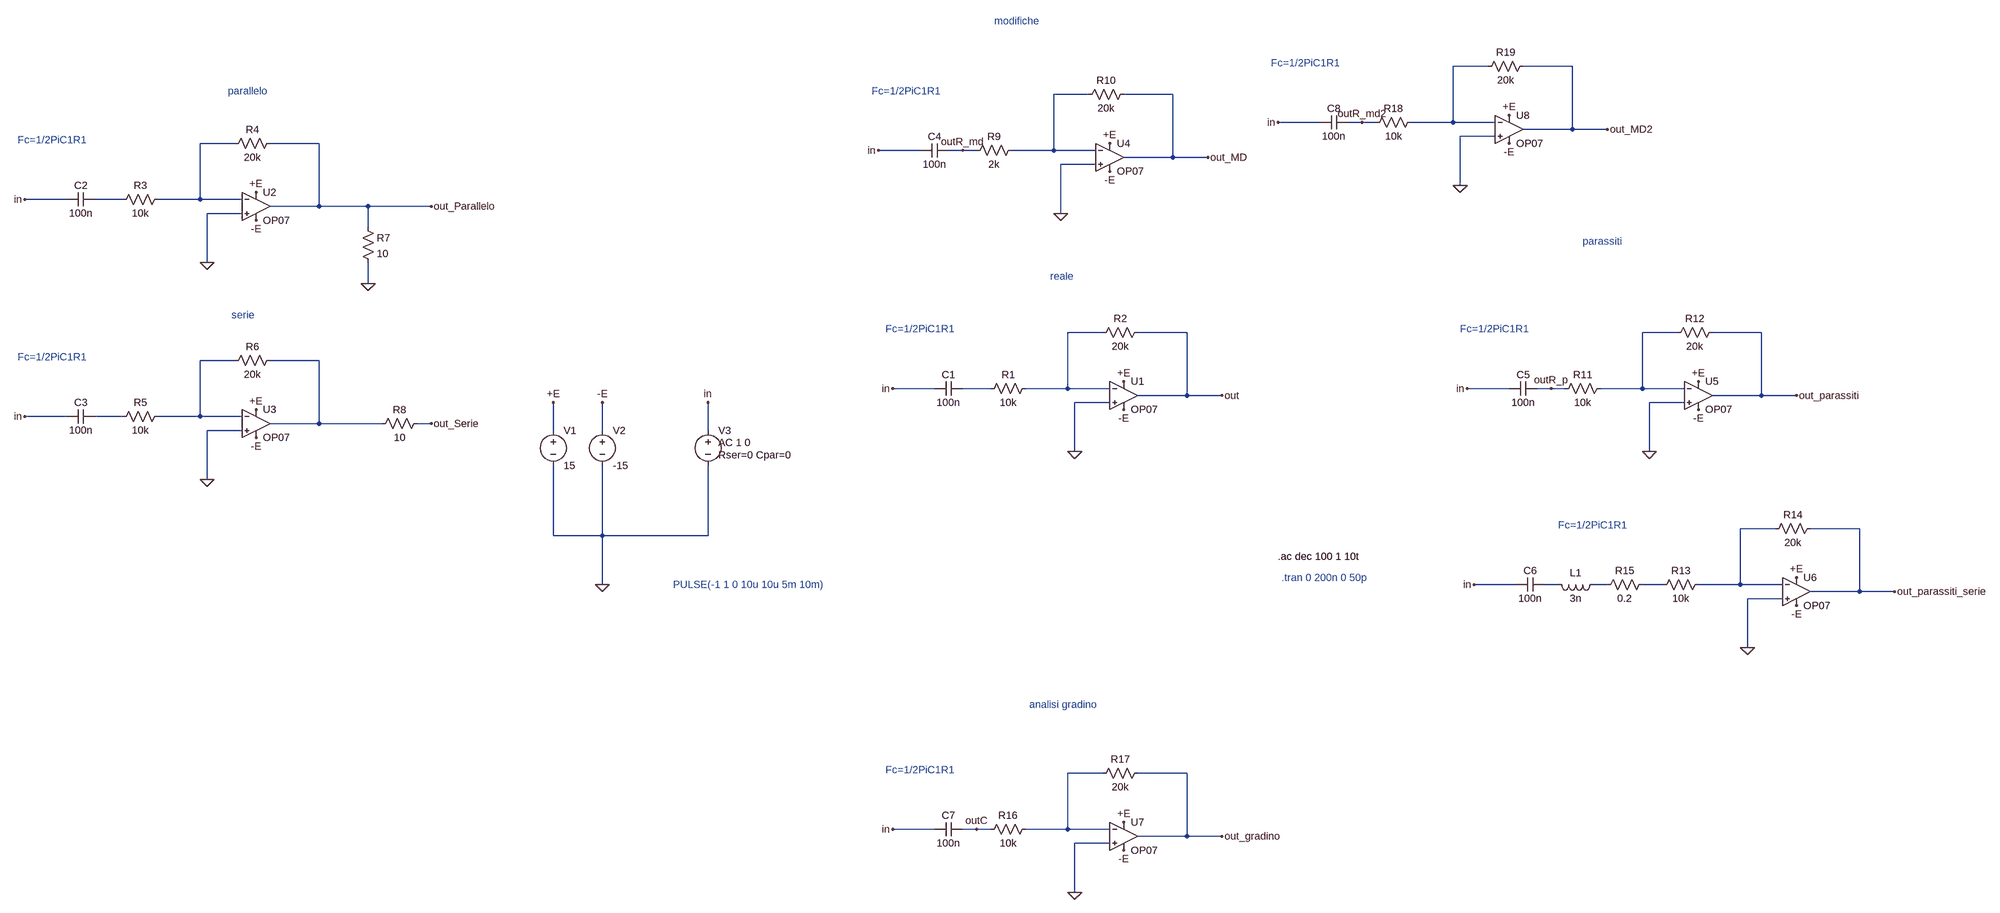
[diagram p0: schematic attivo-reale.asc]
attivo-reale.asc, the LTspice schematic file:
Version 4.1
SHEET 1 2816 916
WIRE 1648 -1056 1568 -1056
WIRE 1840 -1056 1728 -1056
WIRE 736 -992 656 -992
WIRE 928 -992 816 -992
WIRE 1264 -928 1168 -928
WIRE 1360 -928 1328 -928
WIRE 1392 -928 1360 -928
WIRE 1568 -928 1568 -1056
WIRE 1568 -928 1472 -928
WIRE 1664 -928 1568 -928
WIRE 1840 -912 1840 -1056
WIRE 1840 -912 1728 -912
WIRE 1920 -912 1840 -912
WIRE 1664 -896 1584 -896
WIRE -1680 -880 -1760 -880
WIRE -1488 -880 -1600 -880
WIRE 352 -864 256 -864
WIRE 448 -864 416 -864
WIRE 480 -864 448 -864
WIRE 656 -864 656 -992
WIRE 656 -864 560 -864
WIRE 752 -864 656 -864
WIRE 928 -848 928 -992
WIRE 928 -848 816 -848
WIRE 1008 -848 928 -848
WIRE 752 -832 672 -832
WIRE 1584 -784 1584 -896
WIRE -2064 -752 -2160 -752
WIRE -1936 -752 -2000 -752
WIRE -1760 -752 -1760 -880
WIRE -1760 -752 -1856 -752
WIRE -1664 -752 -1760 -752
WIRE -1488 -736 -1488 -880
WIRE -1488 -736 -1600 -736
WIRE -1376 -736 -1488 -736
WIRE -1232 -736 -1376 -736
WIRE -1664 -720 -1744 -720
WIRE 672 -720 672 -832
WIRE -1376 -688 -1376 -736
WIRE -1744 -608 -1744 -720
WIRE -1376 -560 -1376 -608
WIRE 768 -448 688 -448
WIRE 960 -448 848 -448
WIRE 2080 -448 2000 -448
WIRE 2272 -448 2160 -448
WIRE -1680 -384 -1760 -384
WIRE -1488 -384 -1600 -384
WIRE 384 -320 288 -320
WIRE 512 -320 448 -320
WIRE 688 -320 688 -448
WIRE 688 -320 592 -320
WIRE 784 -320 688 -320
WIRE 1696 -320 1600 -320
WIRE 1792 -320 1760 -320
WIRE 1824 -320 1792 -320
WIRE 2000 -320 2000 -448
WIRE 2000 -320 1904 -320
WIRE 2096 -320 2000 -320
WIRE 960 -304 960 -448
WIRE 960 -304 848 -304
WIRE 1040 -304 960 -304
WIRE 2272 -304 2272 -448
WIRE 2272 -304 2160 -304
WIRE 2352 -304 2272 -304
WIRE 784 -288 704 -288
WIRE 2096 -288 2016 -288
WIRE -2064 -256 -2160 -256
WIRE -1936 -256 -2000 -256
WIRE -1760 -256 -1760 -384
WIRE -1760 -256 -1856 -256
WIRE -1664 -256 -1760 -256
WIRE -1488 -240 -1488 -384
WIRE -1488 -240 -1600 -240
WIRE -1344 -240 -1488 -240
WIRE -1232 -240 -1264 -240
WIRE -1664 -224 -1744 -224
WIRE -560 -224 -560 -288
WIRE -448 -224 -448 -288
WIRE -160 -224 -160 -288
WIRE 704 -176 704 -288
WIRE 2016 -176 2016 -288
WIRE -1744 -112 -1744 -224
WIRE 2304 0 2224 0
WIRE 2496 0 2384 0
WIRE -560 16 -560 -144
WIRE -448 16 -448 -144
WIRE -448 16 -560 16
WIRE -160 16 -160 -144
WIRE -160 16 -448 16
WIRE -448 128 -448 16
WIRE 1712 128 1616 128
WIRE 1808 128 1776 128
WIRE 1920 128 1888 128
WIRE 2048 128 2000 128
WIRE 2224 128 2224 0
WIRE 2224 128 2128 128
WIRE 2320 128 2224 128
WIRE 2496 144 2496 0
WIRE 2496 144 2384 144
WIRE 2576 144 2496 144
WIRE 2320 160 2240 160
WIRE 2240 272 2240 160
WIRE 768 624 688 624
WIRE 960 624 848 624
WIRE 384 752 288 752
WIRE 480 752 448 752
WIRE 512 752 480 752
WIRE 688 752 688 624
WIRE 688 752 592 752
WIRE 784 752 688 752
WIRE 960 768 960 624
WIRE 960 768 848 768
WIRE 1040 768 960 768
WIRE 784 784 704 784
WIRE 704 896 704 784
FLAG -560 -288 +E
FLAG -448 -288 -E
FLAG -160 -288 in
FLAG 704 -176 0
FLAG 816 -336 +E
FLAG 816 -272 -E
FLAG 1040 -304 out
FLAG 288 -320 in
FLAG -448 128 0
FLAG -1744 -608 0
FLAG -1632 -768 +E
FLAG -1632 -704 -E
FLAG -2160 -752 in
FLAG -1744 -112 0
FLAG -1632 -272 +E
FLAG -1632 -208 -E
FLAG -2160 -256 in
FLAG -1376 -560 0
FLAG -1232 -736 out_Parallelo
FLAG -1232 -240 out_Serie
FLAG 672 -720 0
FLAG 784 -880 +E
FLAG 784 -816 -E
FLAG 1008 -848 out_MD
FLAG 256 -864 in
FLAG 2016 -176 0
FLAG 2128 -336 +E
FLAG 2128 -272 -E
FLAG 2352 -304 out_parassiti
FLAG 1600 -320 in
FLAG 2240 272 0
FLAG 2352 112 +E
FLAG 2352 176 -E
FLAG 2576 144 out_parassiti_serie
FLAG 1616 128 in
FLAG 704 896 0
FLAG 816 736 +E
FLAG 816 800 -E
FLAG 1040 768 out_gradino
FLAG 288 752 in
FLAG 480 752 outC
FLAG 448 -864 outR_md
FLAG 1584 -784 0
FLAG 1696 -944 +E
FLAG 1696 -880 -E
FLAG 1920 -912 out_MD2
FLAG 1168 -928 in
FLAG 1360 -928 outR_md2
FLAG 1792 -320 outR_p
SYMBOL voltage -560 -240 R0
WINDOW 123 0 0 Left 0
WINDOW 39 0 0 Left 0
SYMATTR InstName V1
SYMATTR Value 15
SYMBOL voltage -448 -240 R0
WINDOW 123 0 0 Left 0
WINDOW 39 0 0 Left 0
SYMATTR InstName V2
SYMATTR Value -15
SYMBOL cap 448 -336 R90
WINDOW 0 0 32 VBottom 2
WINDOW 3 32 32 VTop 2
SYMATTR InstName C1
SYMATTR Value 100n
SYMBOL res 608 -336 R90
WINDOW 0 0 56 VBottom 2
WINDOW 3 32 56 VTop 2
SYMATTR InstName R1
SYMATTR Value 10k
SYMBOL res 864 -464 R90
WINDOW 0 0 56 VBottom 2
WINDOW 3 32 56 VTop 2
SYMATTR InstName R2
SYMATTR Value 20k
SYMBOL cap -2000 -768 R90
WINDOW 0 0 32 VBottom 2
WINDOW 3 32 32 VTop 2
SYMATTR InstName C2
SYMATTR Value 100n
SYMBOL res -1840 -768 R90
WINDOW 0 0 56 VBottom 2
WINDOW 3 32 56 VTop 2
SYMATTR InstName R3
SYMATTR Value 10k
SYMBOL res -1584 -896 R90
WINDOW 0 0 56 VBottom 2
WINDOW 3 32 56 VTop 2
SYMATTR InstName R4
SYMATTR Value 20k
SYMBOL cap -2000 -272 R90
WINDOW 0 0 32 VBottom 2
WINDOW 3 32 32 VTop 2
SYMATTR InstName C3
SYMATTR Value 100n
SYMBOL res -1840 -272 R90
WINDOW 0 0 56 VBottom 2
WINDOW 3 32 56 VTop 2
SYMATTR InstName R5
SYMATTR Value 10k
SYMBOL res -1584 -400 R90
WINDOW 0 0 56 VBottom 2
WINDOW 3 32 56 VTop 2
SYMATTR InstName R6
SYMATTR Value 20k
SYMBOL res -1392 -704 R0
SYMATTR InstName R7
SYMATTR Value 10
SYMBOL res -1248 -256 R90
WINDOW 0 0 56 VBottom 2
WINDOW 3 32 56 VTop 2
SYMATTR InstName R8
SYMATTR Value 10
SYMBOL cap 416 -880 R90
WINDOW 0 0 32 VBottom 2
WINDOW 3 32 32 VTop 2
SYMATTR InstName C4
SYMATTR Value 100n
SYMBOL res 576 -880 R90
WINDOW 0 0 56 VBottom 2
WINDOW 3 32 56 VTop 2
SYMATTR InstName R9
SYMATTR Value 2k
SYMBOL res 832 -1008 R90
WINDOW 0 0 56 VBottom 2
WINDOW 3 32 56 VTop 2
SYMATTR InstName R10
SYMATTR Value 20k
SYMBOL cap 1760 -336 R90
WINDOW 0 0 32 VBottom 2
WINDOW 3 32 32 VTop 2
SYMATTR InstName C5
SYMATTR Value 100n
SYMATTR SpiceLine V=0 Irms=0 Rser=0.2 Lser=3n Rpar=0 Cpar=0
SYMBOL res 1920 -336 R90
WINDOW 0 0 56 VBottom 2
WINDOW 3 32 56 VTop 2
SYMATTR InstName R11
SYMATTR Value 10k
SYMBOL res 2176 -464 R90
WINDOW 0 0 56 VBottom 2
WINDOW 3 32 56 VTop 2
SYMATTR InstName R12
SYMATTR Value 20k
SYMBOL cap 1776 112 R90
WINDOW 0 0 32 VBottom 2
WINDOW 3 32 32 VTop 2
SYMATTR InstName C6
SYMATTR Value 100n
SYMATTR SpiceLine V=0 Irms=0 Rser=0 Lser=0 Rpar=0 Cpar=0
SYMBOL res 2144 112 R90
WINDOW 0 0 56 VBottom 2
WINDOW 3 32 56 VTop 2
SYMATTR InstName R13
SYMATTR Value 10k
SYMBOL res 2400 -16 R90
WINDOW 0 0 56 VBottom 2
WINDOW 3 32 56 VTop 2
SYMATTR InstName R14
SYMATTR Value 20k
SYMBOL ind 1904 112 R90
WINDOW 0 5 56 VBottom 2
WINDOW 3 32 56 VTop 2
SYMATTR InstName L1
SYMATTR Value 3n
SYMATTR SpiceLine Rser=1m
SYMBOL res 2016 112 R90
WINDOW 0 0 56 VBottom 2
WINDOW 3 32 56 VTop 2
SYMATTR InstName R15
SYMATTR Value 0.2
SYMBOL voltage -160 -240 R0
WINDOW 123 24 44 Left 2
WINDOW 39 24 72 Left 2
WINDOW 3 24 100 Left 2
SYMATTR Value2 AC 1 0
SYMATTR SpiceLine Rser=0 Cpar=0
SYMATTR Value ""
SYMATTR InstName V3
SYMBOL cap 448 736 R90
WINDOW 0 0 32 VBottom 2
WINDOW 3 32 32 VTop 2
SYMATTR InstName C7
SYMATTR Value 100n
SYMBOL res 608 736 R90
WINDOW 0 0 56 VBottom 2
WINDOW 3 32 56 VTop 2
SYMATTR InstName R16
SYMATTR Value 10k
SYMBOL res 864 608 R90
WINDOW 0 0 56 VBottom 2
WINDOW 3 32 56 VTop 2
SYMATTR InstName R17
SYMATTR Value 20k
SYMBOL OpAmps\\OP07 816 -368 R0
SYMATTR InstName U1
SYMBOL OpAmps\\OP07 -1632 -800 R0
SYMATTR InstName U2
SYMBOL OpAmps\\OP07 -1632 -304 R0
SYMATTR InstName U3
SYMBOL OpAmps\\OP07 784 -912 R0
SYMATTR InstName U4
SYMBOL OpAmps\\OP07 2128 -368 R0
SYMATTR InstName U5
SYMBOL OpAmps\\OP07 2352 80 R0
SYMATTR InstName U6
SYMBOL OpAmps\\OP07 816 704 R0
SYMATTR InstName U7
SYMBOL cap 1328 -944 R90
WINDOW 0 0 32 VBottom 2
WINDOW 3 32 32 VTop 2
SYMATTR InstName C8
SYMATTR Value 100n
SYMBOL res 1488 -944 R90
WINDOW 0 0 56 VBottom 2
WINDOW 3 32 56 VTop 2
SYMATTR InstName R18
SYMATTR Value 10k
SYMBOL res 1744 -1072 R90
WINDOW 0 0 56 VBottom 2
WINDOW 3 32 56 VTop 2
SYMATTR InstName R19
SYMATTR Value 20k
SYMBOL OpAmps\\OP07 1696 -976 R0
SYMATTR InstName U8
TEXT 272 -456 Left 2 ;Fc=1/2PiC1R1
TEXT 1168 64 Left 2 !.ac dec 100 1 10t
TEXT 1176 112 Left 2 ;.tran 0 200n 0 50p
TEXT -2176 -888 Left 2 ;Fc=1/2PiC1R1
TEXT -2176 -392 Left 2 ;Fc=1/2PiC1R1
TEXT 240 -1000 Left 2 ;Fc=1/2PiC1R1
TEXT -1696 -1000 Left 2 ;parallelo
TEXT -1688 -488 Left 2 ;serie
TEXT 520 -1160 Left 2 ;modifiche
TEXT 1584 -456 Left 2 ;Fc=1/2PiC1R1
TEXT 1864 -656 Left 2 ;parassiti
TEXT 1808 -8 Left 2 ;Fc=1/2PiC1R1
TEXT 648 -576 Left 2 ;reale
TEXT 272 616 Left 2 ;Fc=1/2PiC1R1
TEXT 600 432 Left 2 ;analisi gradino
TEXT 1152 -1064 Left 2 ;Fc=1/2PiC1R1
TEXT -240 128 Left 2 ;PULSE(-1 1 0 10u 10u 5m 10m)

The netlist it stands for:
* attivo-reale.asc
V1 +E 0 15
V2 -E 0 -15
C1 N009 in 100n
R1 N005 N009 10k
R2 out N005 20k
C2 N004 in 100n
R3 N003 N004 10k
R4 out_Parallelo N003 20k
C3 N010 in 100n
R5 N007 N010 10k
R6 N008 N007 20k
R7 out_Parallelo 0 10
R8 out_Serie N008 10
C4 outR_md in 100n
R9 N002 outR_md 2k
R10 out_MD N002 20k
C5 outR_p in 100n V=0 Irms=0 Rser=0.2 Lser=3n Rpar=0 Cpar=0
R11 N006 outR_p 10k
R12 out_parassiti N006 20k
C6 N012 in 100n V=0 Irms=0 Rser=0 Lser=0 Rpar=0 Cpar=0
R13 N011 N014 10k
R14 out_parassiti_serie N011 20k
L1 N013 N012 3n Rser=1m
R15 N014 N013 0.2
V3 in 0 AC 1 0 Rser=0 Cpar=0
C7 outC in 100n
R16 N015 outC 10k
R17 out_gradino N015 20k
X§U1 0 N005 +E -E out LT1001  ; OP07, pins In+ In- V+ V- OUT
X§U2 0 N003 +E -E out_Parallelo LT1001  ; OP07, pins In+ In- V+ V- OUT
X§U3 0 N007 +E -E N008 LT1001  ; OP07, pins In+ In- V+ V- OUT
X§U4 0 N002 +E -E out_MD LT1001  ; OP07, pins In+ In- V+ V- OUT
X§U5 0 N006 +E -E out_parassiti LT1001  ; OP07, pins In+ In- V+ V- OUT
X§U6 0 N011 +E -E out_parassiti_serie LT1001  ; OP07, pins In+ In- V+ V- OUT
X§U7 0 N015 +E -E out_gradino LT1001  ; OP07, pins In+ In- V+ V- OUT
C8 outR_md2 in 100n
R18 N001 outR_md2 10k
R19 out_MD2 N001 20k
X§U8 0 N001 +E -E out_MD2 LT1001  ; OP07, pins In+ In- V+ V- OUT
* Fc=1/2PiC1R1
.ac dec 100 1 10t
* .tran 0 200n 0 50p
* Fc=1/2PiC1R1
* Fc=1/2PiC1R1
* Fc=1/2PiC1R1
* parallelo
* serie
* modifiche
* Fc=1/2PiC1R1
* parassiti
* Fc=1/2PiC1R1
* reale
* Fc=1/2PiC1R1
* analisi gradino
* Fc=1/2PiC1R1
* PULSE(-1 1 0 10u 10u 5m 10m)
.lib LTC.lib
.backanno
.end

* Results of the author's LTspice run, read from the files saved beside the schematic
* Operating Point, zero values left out:
*   V(+e) = 15 V
*   V(-e) = -15 V
*   V(in) = -1 V
*   I(V1) = -18 mA
*   I(V2) = 18 mA
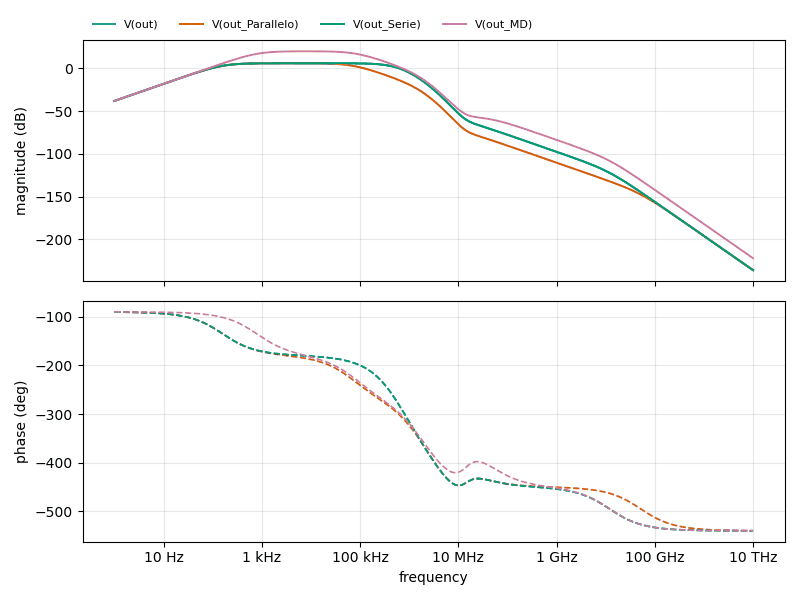
[diagram p1: AC Analysis of attivo-reale.asc, plotted from the saved traces]
* AC Analysis, 1 run:
*   V(out): -38.02 dB at 1 Hz, -236.01 dB at 10 THz, peak 6.02 dB at 8.318 kHz, 3 dB below the peak at 159.1 Hz and 404.2 kHz
*   V(out_Parallelo): -38.02 dB at 1 Hz, -236.01 dB at 10 THz, peak 6.01 dB at 3.311 kHz, 3 dB below the peak at 158.7 Hz and 70.6 kHz
*   V(out_Serie): -38.02 dB at 1 Hz, -236.01 dB at 10 THz, peak 6.02 dB at 8.318 kHz, 3 dB below the peak at 159.1 Hz and 404.2 kHz
*   V(out_MD): -38.02 dB at 1 Hz, -222.03 dB at 10 THz, peak 20.00 dB at 8.128 kHz, 3 dB below the peak at 788.3 Hz and 84.56 kHz